# EAGLE design ds1307 ek narrow (EAGLE 6.2)
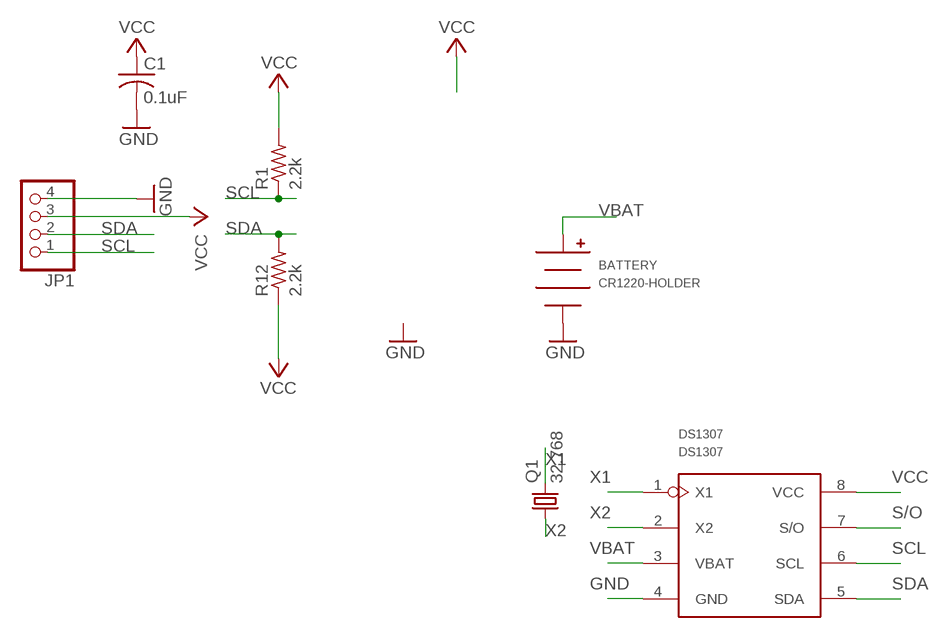
[diagram p0: schematic, sheet 1]

## Parts
BATTERY  CR1220-HOLDER  [HARWIN-CR1220]
C1  0.1uF  C-USC0805  [C0805]
DS1307  DS1307  [SO08]
JP1  PINHD-1X4  [1X04]
Q1  32.768  CRYTALTC38H  [TC38H]
R1  2.2k  R-US_R0805  [R0805]
R12  2.2k  R-US_R0805  [R0805]

## Nets
GND: BATTERY.NEG C1.2 DS1307.4(GND) JP1.4
S/O: DS1307.7(S/O)
SCL: DS1307.6(SCL) JP1.1 R1.1
SDA: DS1307.5(SDA) JP1.2 R12.2
VBAT: BATTERY.POS DS1307.3(VBAT)
VCC: C1.1 DS1307.8(VCC) JP1.3 R1.2 R12.1
X1: DS1307.1(X1) Q1.2
X2: DS1307.2(X2) Q1.1

## Library data of the parts
BATTERY = battery-holder:CR1220-HOLDER
C1 = adafruit:C-US: CAPACITOR, American symbol
DS1307 = Seeed:DS1307
JP1 = pinhead:PINHD-1X4: PIN HEADER
Q1 = crystal:CRYTAL: CRYSTAL
R1 R12 = resistor:R-US_: RESISTOR, American symbol

## Net classes
1 Power: width 0.3 mm, drill 0.406 mm, clearance 0.178 mm

## Board
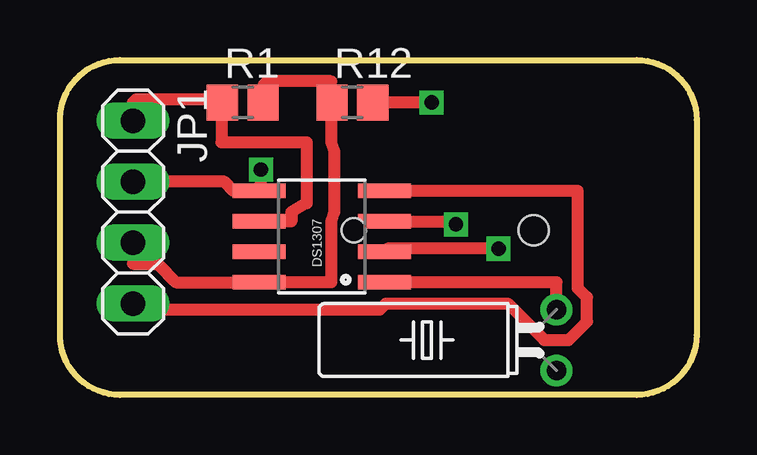
[diagram p1: board, top side]
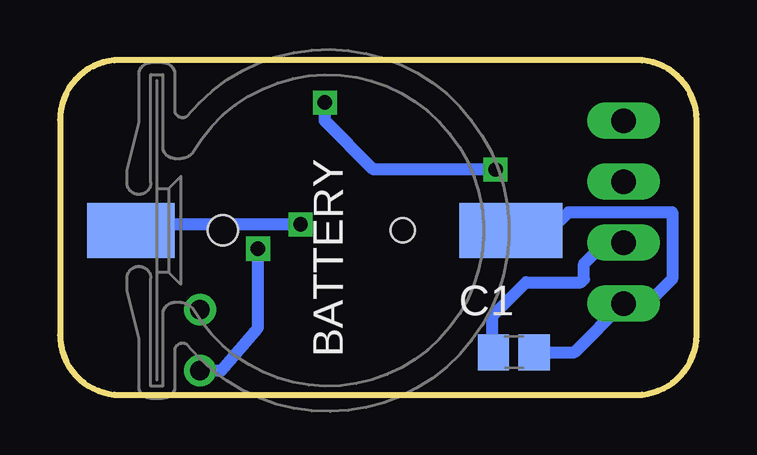
[diagram p2: board, bottom side, seen from below]

Size 26.54 x 13.97 mm. Coordinates in mm from the lower left corner, seen from the top.
Outline: 26.54,11.47 26.54,2.5 arc-90 24.04,0 2.5,0 arc-90 0,2.5 0,11.47 arc-90 2.5,13.97 24.04,13.97 arc-90 26.54,11.47
Copper layers (1*16): Top 0.035mm / dielectric 1.5mm / Bottom 0.035mm
Design rules: minimum track width 20mil, minimum drill 20mil, track to track 12mil, track to pad 12mil, pad to pad 10mil, via to via 12mil, smd to smd 0mil, copper to edge 20mil, drill to drill 8mil, minimum pad ring 10mil, minimum via ring 8mil, stop-mask expansion 4mil, vias tented up to drill 20mil, thermal gap 10mil

### Footprints (pad centres in the part's own frame; a part is rotated, then mirrored left to right if it is on the bottom)
HARWIN-CR1220 = smd 2.3 x 4.3: NEG 0,8.26 | smd 2.3 x 3.66: POS 0,-7.58 | hole 1: 0,3.75 | hole 1.25: 0,-3.75
C0805 = smd 1.3 x 1.5: 1 -0.85,0; 2 0.85,0
SO08 = smd 0.61 x 2.21: 1 -1.905,-2.616; 2 -0.635,-2.616; 3 0.635,-2.616; 4 1.905,-2.616; 5 1.905,2.616; 6 0.635,2.616; 7 -0.635,2.616; 8 -1.905,2.616
1X04 = drill 1.016 long: 1 -3.81,0; 2 -1.27,0; 3 1.27,0; 4 3.81,0
TC38H = drill 0.813: 1 -1.27,0; 2 1.27,0
R0805 = smd 1.3 x 1.5: 1 -0.85,0; 2 0.85,0

### Placement (x,y rotation side)
BATTERY  16,6.86 270 bottom
C1  7.62,1.78 0 bottom
DS1307  10.92,6.6 90 top
JP1  3.05,7.62 270 top
Q1  20.7,2.29 90 top
R1  7.62,12.19 0 top
R12  12.19,12.19 0 top

### Tracks (layer width: path | path; a pad name or v marks a point on that pad's centre or on a via)
GND
  Top 0.508: DS1307.4 21.59,8.51 21.59,4.45 21.97,4.06 21.97,3.05 21.21,2.29 20.19,2.29 18.67,3.81 13.59,3.81 13.34,3.56 3.05,3.56 JP1.4
  Bottom 0.508: BATTERY.NEG 6.1,6.86 5.33,7.62 1.02,7.62 1.02,4.83 2.03,3.81 JP1.4 5.08,1.78 C1.2
SCL
  Top 0.508: JP1.1 3.05,12.19 3.17,12.32 6.73,12.32 6.73,12.19 R1.1 6.73,12.07 6.73,10.54 10.29,10.54 10.29,8 9.65,7.62 9.65,7.24 DS1307.6
SDA  (via drill 0.6)
  Top 0.508: JP1.2 6.86,8.89 7.24,8.51 DS1307.5 8.38,8.51 v8.38,9.4 | v15.49,12.19 R12.2
  Bottom 0.508: v8.38,9.4 13.46,9.4 15.49,11.43 v15.49,12.19
VBAT  (via drill 0.6)
  Top 0.508: DS1307.3 16.13,7.24 v16.51,7.11
  Bottom 0.508: v16.51,7.11 22.82,7.11 BATTERY.POS
VCC
  Top 0.508: R1.2 8.51,12.19 8.51,12.95 8.64,13.08 11.3,13.08 11.3,12.19 R12.1 11.3,12.07 11.3,10.54 11.43,10.16 11.43,7.62 11.3,7.24 11.3,4.7 DS1307.8 4.83,4.7 4.06,5.46 3.05,5.46 JP1.3
  Bottom 0.508: JP1.3 3.81,6.35 4.7,5.46 4.7,4.83 4.83,4.7 7.11,4.7 8.51,3.3 8.51,1.78 C1.1
X1
  Top 0.508: DS1307.1 20.7,4.7 Q1.2
X2  (via drill 0.6)
  Top 0.508: v18.29,6.1 13.66,6.1 DS1307.2
  Bottom 0.508: Q1.1 19.81,1.02 18.29,2.79 v18.29,6.1